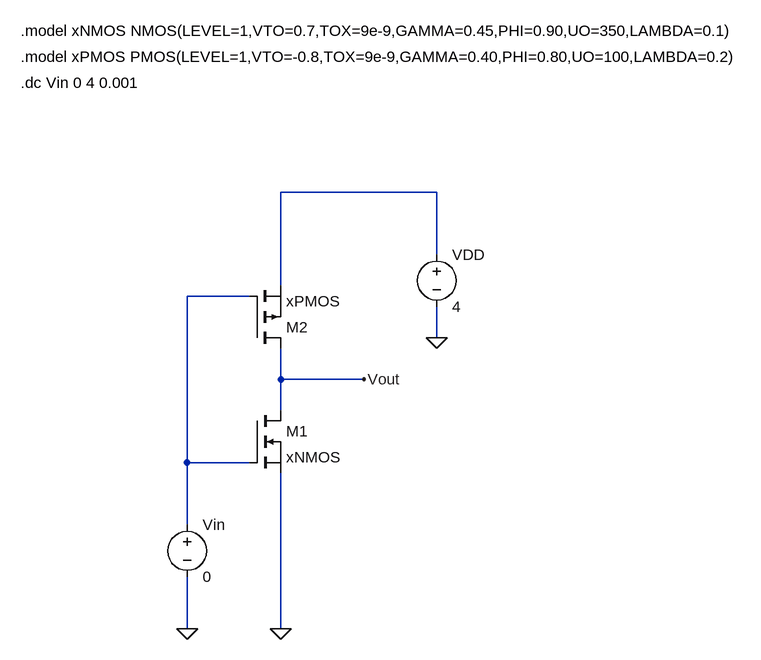
[diagram p0: schematic Chapter03_SPICE04.asc]
Chapter03_SPICE04.asc, the LTspice schematic file:
Version 4
SHEET 1 1244 1060
WIRE 688 368 448 368
WIRE 688 464 688 368
WIRE 448 512 448 368
WIRE 400 528 304 528
WIRE 688 592 688 544
WIRE 448 656 448 608
WIRE 576 656 448 656
WIRE 448 704 448 656
WIRE 304 784 304 528
WIRE 400 784 304 784
WIRE 304 880 304 784
WIRE 304 1040 304 960
WIRE 448 1040 448 800
FLAG 448 1040 0
FLAG 304 1040 0
FLAG 688 592 0
FLAG 576 656 Vout
SYMBOL nmos 400 704 R0
SYMATTR InstName M1
SYMATTR Value xNMOS
SYMBOL voltage 304 864 R0
WINDOW 123 0 0 Left 0
WINDOW 39 0 0 Left 0
SYMATTR InstName Vin
SYMATTR Value 0
SYMBOL voltage 688 448 R0
WINDOW 123 0 0 Left 0
WINDOW 39 0 0 Left 0
SYMATTR InstName VDD
SYMATTR Value 4
SYMBOL pmos 400 608 M180
SYMATTR InstName M2
SYMATTR Value xPMOS
TEXT 48 120 Left 2 !.model xNMOS NMOS(LEVEL=1,VTO=0.7,TOX=9e-9,GAMMA=0.45,PHI=0.90,UO=350,LAMBDA=0.1)
TEXT 48 200 Left 2 !.dc Vin 0 4 0.001
TEXT 48 160 Left 2 !.model xPMOS PMOS(LEVEL=1,VTO=-0.8,TOX=9e-9,GAMMA=0.40,PHI=0.80,UO=100,LAMBDA=0.2)

The netlist it stands for:
* Chapter03_SPICE04.asc
M1 Vout N002 0 0 xNMOS
Vin N002 0 0
VDD N001 0 4
M2 Vout N002 N001 N001 xPMOS
.model NMOS NMOS
.model PMOS PMOS
.lib standard.mos
.model xNMOS NMOS(LEVEL=1,VTO=0.7,TOX=9e-9,GAMMA=0.45,PHI=0.90,UO=350,LAMBDA=0.1)
.dc Vin 0 4 0.001
.model xPMOS PMOS(LEVEL=1,VTO=-0.8,TOX=9e-9,GAMMA=0.40,PHI=0.80,UO=100,LAMBDA=0.2)
.backanno
.end